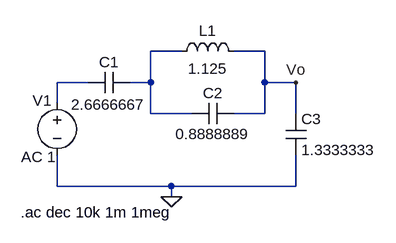
[diagram p0: schematic Ejercicio_b.asc]
Ejercicio_b.asc, the LTspice schematic file:
Version 4
SHEET 1 880 680
WIRE 176 80 128 80
WIRE 304 80 256 80
WIRE 32 128 -16 128
WIRE 128 128 128 80
WIRE 128 128 96 128
WIRE 304 128 304 80
WIRE 352 128 304 128
WIRE -16 160 -16 128
WIRE 128 176 128 128
WIRE 192 176 128 176
WIRE 304 176 304 128
WIRE 304 176 256 176
WIRE 352 176 352 128
WIRE -16 288 -16 240
WIRE 160 288 -16 288
WIRE 352 288 352 240
WIRE 352 288 160 288
WIRE 160 304 160 288
FLAG 352 128 Vo
FLAG 160 304 0
SYMBOL cap 96 112 R90
WINDOW 0 0 32 VBottom 2
WINDOW 3 34 33 VTop 2
SYMATTR InstName C1
SYMATTR Value 2.6666667
SYMBOL cap 256 160 R90
WINDOW 0 0 32 VBottom 2
WINDOW 3 32 32 VTop 2
SYMATTR InstName C2
SYMATTR Value 0.8888889
SYMBOL ind 160 96 R270
WINDOW 0 32 56 VTop 2
WINDOW 3 5 56 VBottom 2
SYMATTR InstName L1
SYMATTR Value 1.125
SYMBOL cap 336 176 R0
SYMATTR InstName C3
SYMATTR Value 1.3333333
SYMBOL voltage -16 144 R0
WINDOW 0 -38 12 Left 2
WINDOW 3 -32 100 Left 2
WINDOW 123 -55 99 Left 2
WINDOW 39 0 0 Left 0
SYMATTR InstName V1
SYMATTR Value ""
SYMATTR Value2 AC 1
TEXT -72 328 Left 2 !.ac dec 10k 1m 1meg

The netlist it stands for:
* Ejercicio_b.asc
C1 N001 N002 2.6666667
C2 Vo N001 0.8888889
L1 N001 Vo 1.125
C3 Vo 0 1.3333333
V1 N002 0 AC 1
.ac dec 10k 1m 1meg
.backanno
.end